# EAGLE design baby_board (EAGLE 7.1.0)
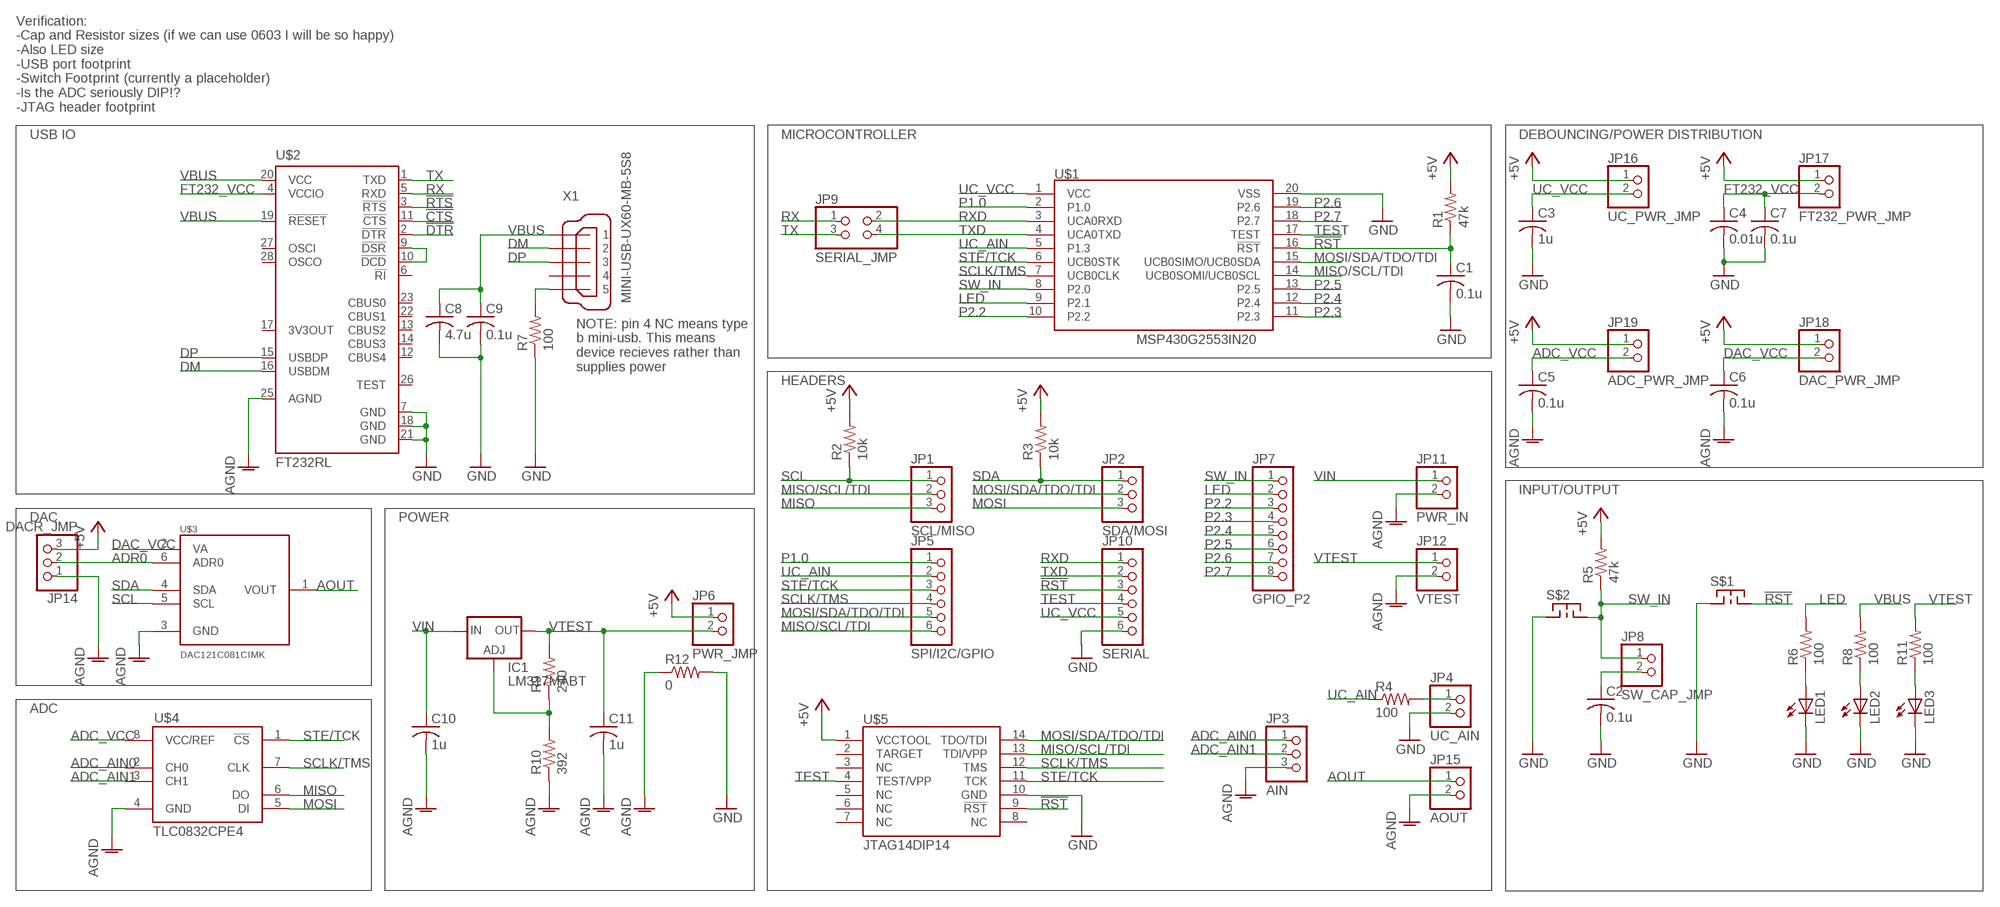
[diagram p0: schematic, sheet 1]

## Parts
C1  0.1u  C-USC0603  [C0603]
C2  0.1u  C-USC0603  [C0603]
C3  1u  C-USC0603  [C0603]
C4  0.01u  C-USC0603  [C0603]
C5  0.1u  C-USC0603  [C0603]
C6  0.1u  C-USC0603  [C0603]
C7  0.1u  C-USC0603  [C0603]
C8  4.7u  C-USC0603  [C0603]
C9  0.1u  C-USC0603  [C0603]
C10  1u  C-USC0603  [C0603]
C11  1u  C-USC0603  [C0603]
IC1  LM317MABT  [TO220L1]
JP1  SCL/MISO  PINHD-1X3  [1X03]
JP2  SDA/MOSI  PINHD-1X3  [1X03]
JP3  AIN  PINHD-1X3  [1X03]
JP4  UC_AIN  PINHD-1X2  [1X02]
JP5  SPI/I2C/GPIO  PINHD-1X6  [1X06]
JP6  PWR_JMP  PINHD-1X2  [1X02]
JP7  GPIO_P2  PINHD-1X8  [1X08]
JP8  SW_CAP_JMP  PINHD-1X2  [1X02]
JP9  SERIAL_JMP  PINHD-2X2  [2X02]
JP10  SERIAL  PINHD-1X6  [1X06]
JP11  PWR_IN  PINHD-1X2  [1X02]
JP12  VTEST  PINHD-1X2  [1X02]
JP14  DACR_JMP  PINHD-1X3  [1X03]
JP15  AOUT  PINHD-1X2  [1X02]
JP16  UC_PWR_JMP  PINHD-1X2  [1X02]
JP17  FT232_PWR_JMP  PINHD-1X2  [1X02]
JP18  DAC_PWR_JMP  PINHD-1X2  [1X02]
JP19  ADC_PWR_JMP  PINHD-1X2  [1X02]
LED1  LEDCHIP-LED0805  [CHIP-LED0805]
LED2  LEDCHIP-LED0805  [CHIP-LED0805]
LED3  LEDCHIP-LED0805  [CHIP-LED0805]
R1  47k  R-US_R0603  [R0603]
R2  10k  R-US_R0603  [R0603]
R3  10k  R-US_R0603  [R0603]
R4  100  R-US_R0603  [R0603]
R5  47k  R-US_R0603  [R0603]
R6  100  R-US_R0603  [R0603]
R7  100  R-US_R0603  [R0603]
R8  100  R-US_R0603  [R0603]
R9  240  R-US_R0603  [R0603]
R10  392  R-US_R0603  [R0603]
R11  100  R-US_R0603  [R0603]
R12  0  R-US_R0603  [R0603]
S$1  SWITCH_MOM_2_TEST  [TEST]
S$2  SWITCH_MOM_2_TEST  [TEST]
U$1  MSP430G2553IN20  [20-PDIP]
U$2  FT232RL  [SSOP28]
U$3  DAC121C081CIMK  [SOT-6]
U$4  TLC0832CPE4  [DIL08]
U$5  JTAG14DIP14  [DIL14]
X1  MINI-USB-UX60-MB-5S8  [UX60-MB-5S8]

## Nets
!CTS: U$2.11(!CTS)
!DTR: U$2.2(!DTR)
!RST: C1.1 JP10.3 R1.1 S$1.2 U$1.16(!RST) U$5.9(!RST)
!RTS: U$2.3(!RTS)
+5V: JP6.1 JP14.3 JP16.1 JP17.1 JP18.1 JP19.1 R1.2 R2.2 R3.2 R5.2 U$5.1(VCCTOOL)
ADC_AIN0: JP3.1 U$4.2(CH0)
ADC_AIN1: JP3.2 U$4.3(CH1)
ADC_VCC: C5.1 JP19.2 U$4.8(VCC/REF)
ADR0: JP14.2 U$3.6(ADR0)
AGND: C5.2 C6.2 C10.2 C11.2 JP3.3 JP11.2 JP12.2 JP14.1 JP15.2 R10.1 R12.1 U$2.25(AGND) U$3.3(GND) U$4.4(GND)
AOUT: JP15.1 U$3.1(VOUT)
DAC_VCC: C6.1 JP18.2 U$3.2(VA)
DM: U$2.16(USBDM) X1.2
DP: U$2.15(USBDP) X1.3
FT232_VCC: C4.1 C7.1 JP17.2 U$2.4(VCCIO)
GND: C1.2 C2.2 C3.2 C4.2 C7.2 C8.2 C9.2 JP4.2 JP10.6 LED1.C LED2.C LED3.C R7.1 R12.2 S$1.1 S$2.1 U$1.20(VSS) U$2.7(GND) U$2.18(GND) U$2.21(GND) U$5.10(GND)
LED: JP7.2 R6.2 U$1.9(P2.1)
MISO: JP1.3 U$4.6(DO)
MISO/SCL/TDI: JP1.2 JP5.6 U$1.14(UCB0SOMI/UCB0SCL) U$5.13(TDI/VPP)
MOSI: JP2.3 U$4.5(DI)
MOSI/SDA/TDO/TDI: JP2.2 JP5.5 U$1.15(UCB0SIMO/UCB0SDA) U$5.14(TDO/TDI)
N$1: JP4.1 R4.2
N$2: C2.1 JP8.2
N$3: LED1.A R6.1
N$4: U$2.9(!DSR) U$2.10(!DCD)
N$5: R7.2 X1.5
N$6: LED2.A R8.1
N$8: IC1.1(ADJ) R9.1 R10.2
N$9: LED3.A R11.1
P1.0: JP5.1 U$1.2(P1.0)
P2.2: JP7.3 U$1.10(P2.2)
P2.3: JP7.4 U$1.11(P2.3)
P2.4: JP7.5 U$1.12(P2.4)
P2.5: JP7.6 U$1.13(P2.5)
P2.6: JP7.7 U$1.19(P2.6)
P2.7: JP7.8 U$1.18(P2.7)
RX: JP9.1 U$2.5(RXD)
RXD: JP9.2 JP10.1 U$1.3(UCA0RXD)
SCL: JP1.1 R2.1 U$3.5(SCL)
SCLK/TMS: JP5.4 U$1.7(UCB0CLK) U$4.7(CLK) U$5.12(TMS)
SDA: JP2.1 R3.1 U$3.4(SDA)
STE/TCK: JP5.3 U$1.6(UCB0STK) U$4.1(!CS) U$5.11(TCK)
SW_IN: JP7.1 JP8.1 R5.1 S$2.2 U$1.8(P2.0)
TEST: JP10.4 U$1.17(TEST) U$5.4(TEST/VPP)
TX: JP9.3 U$2.1(TXD)
TXD: JP9.4 JP10.2 U$1.4(UCA0TXD)
UC_AIN: JP5.2 R4.1 U$1.5(P1.3)
UC_VCC: C3.1 JP10.5 JP16.2 U$1.1(VCC)
VBUS: C8.1 C9.1 R8.2 U$2.19(!RESET) U$2.20(VCC) X1.1
VIN: C10.1 IC1.3(IN) JP11.1
VTEST: C11.1 IC1.2(OUT) JP6.2 JP12.1 R9.2 R11.2
Unconnected: U$2.6(!RI) U$2.12(CBUS4) U$2.13(CBUS2) U$2.14(CBUS3) U$2.17(3V3OUT) U$2.22(CBUS1) U$2.23(CBUS0) U$2.26(TEST) U$2.27(OSCI) U$2.28(OSCO) U$5.2(TARGET) U$5.3(NC) U$5.5(NC) U$5.6(NC) U$5.7(NC) U$5.8(NC) X1.4

## Notes on the sheet
- Verification:
  -Cap and Resistor sizes (if we can use 0603 I will be so happy)
  -Also LED size
  -USB port footprint
  -Switch Footprint (currently a placeholder)
  -Is the ADC seriously DIP\!?
  -JTAG header footprint
- USB IO | MICROCONTROLLER | DEBOUNCING/POWER DISTRIBUTION
- NOTE: pin 4 NC means type
  b mini-usb. This means 
  device recieves rather than 
  supplies power
- HEADERS
- INPUT/OUTPUT
- DAC | POWER
- ADC

## Library data of the parts
C1-C11 = resistor:C-US: CAPACITOR, American symbol
IC1 = v-reg:LM317?*: 500 mA Adjustable Output Positive Voltage Regulator Source: http://www.onsemi.co.jp .. LM317M-D.PDF
JP1-JP3 JP14 = pinhead:PINHD-1X3: PIN HEADER
JP4 JP6 JP8 JP11 JP12 JP15-JP19 = pinhead:PINHD-1X2: PIN HEADER
JP5 JP10 = pinhead:PINHD-1X6: PIN HEADER
JP7 = pinhead:PINHD-1X8: PIN HEADER
JP9 = pinhead:PINHD-2X2: PIN HEADER
LED1-LED3 = led:LED: LED OSRAM: - CHIPLED LG R971, LG N971, LY N971, LG Q971, LY Q971, LO R971, LY R971 LH N974, LH R974 LS Q976, LO Q976, LY Q976 LO Q996 - Hyper CHIPLED LW Q18S LB Q993, LB Q99A, LB R99A - SideLED LS A670, LO A670, LY A670, LG A670, LP A670 LB A673, LV A673, LT A673, LW A673 LH A674 LY A675 LS A676, LA A676, LO A676, LY A676, LW A676 LS A679, LY A679, LG A679 - Hyper Micro SIDELED® LS Y876, LA Y876, LO Y876, LY Y876 LT Y87S - SmartLED LW L88C, LW L88S LB L89C, LB L89S, LG L890 LS L89K, LO L89K, LY L89K LS L896, LA L896, LO L896, LY L896 - TOPLED LS T670, LO T670, LY T670, LG T670, LP T670 LSG T670, LSP T670, LSY T670, LOP T670, LYG T670 LG T671, LOG T671, LSG T671 LB T673, LV T673, LT T673, LW T673 LH T674 LS T676, LA T676, LO T676, LY T676, LB T676, LH T676, LSB T676, LW T676 LB T67C, LV T67C, LT T67C, LS T67K, LO T67K, LY T67K, LW E67C LS E67B, LA E67B, LO E67B, LY E67B, LB E67C, LV E67C, LT E67C LW T67C LS T679, LY T679, LG T679 LS T770, LO T770, LY T770, LG T770, LP T770 LB T773, LV T773, LT T773, LW T773 LH T774 LS E675, LA E675, LY E675, LS T675 LS T776, LA T776, LO T776, LY T776, LB T776 LHGB T686 LT T68C, LB T68C - Hyper Mini TOPLED® LB M676 - Mini TOPLED Santana® LG M470 LS M47K, LO M47K, LY M47K Source: http://www.osram.convergy.de LUXEON: - LUMILED® LXK2-PW12-R00, LXK2-PW12-S00, LXK2-PW14-U00, LXK2-PW14-V00 LXK2-PM12-R00, LXK2-PM12-S00, LXK2-PM14-U00 LXK2-PE12-Q00, LXK2-PE12-R00, LXK2-PE12-S00, LXK2-PE14-T00, LXK2-PE14-U00 LXK2-PB12-K00, LXK2-PB12-L00, LXK2-PB12-M00, LXK2-PB14-N00, LXK2-PB14-P00, LXK2-PB14-Q00 LXK2-PR12-L00, LXK2-PR12-M00, LXK2-PR14-Q00, LXK2-PR14-R00 LXK2-PD12-Q00, LXK2-PD12-R00, LXK2-PD12-S00 LXK2-PH12-R00, LXK2-PH12-S00 LXK2-PL12-P00, LXK2-PL12-Q00, LXK2-PL12-R00 Source: www.luxeon.com KINGBRIGHT: KA-3528ASYC Source: www.kingbright.com
R1-R12 = resistor:R-US_: RESISTOR, American symbol
S$1 S$2 = switch_glaser:SWITCH_MOM_2_
U$1 = msp430:MSP430: 16-bit microcontroller, 20 pin variant
U$2 = ftdichip:FT232R: Source: http://www.ftdichip.com/Documents/DataSheets/DS_FT232R_v104.pdf; MPN: FT232RL; OC_FARNELL: 1146032; OC_NEWARK: 91K9918
U$3 = dac_glaser:DAC121C081
U$4 = adc_glaser:TLC0832C
U$5 = jtag_glaser:JTAG14
X1 = con-hirose:MINI-USB-: MINI USB Connector Source: http://www.hirose.co.jp/cataloge_hp/e24000019.pdf; OC_FARNELL: unknown; OC_NEWARK: unknown

## Board
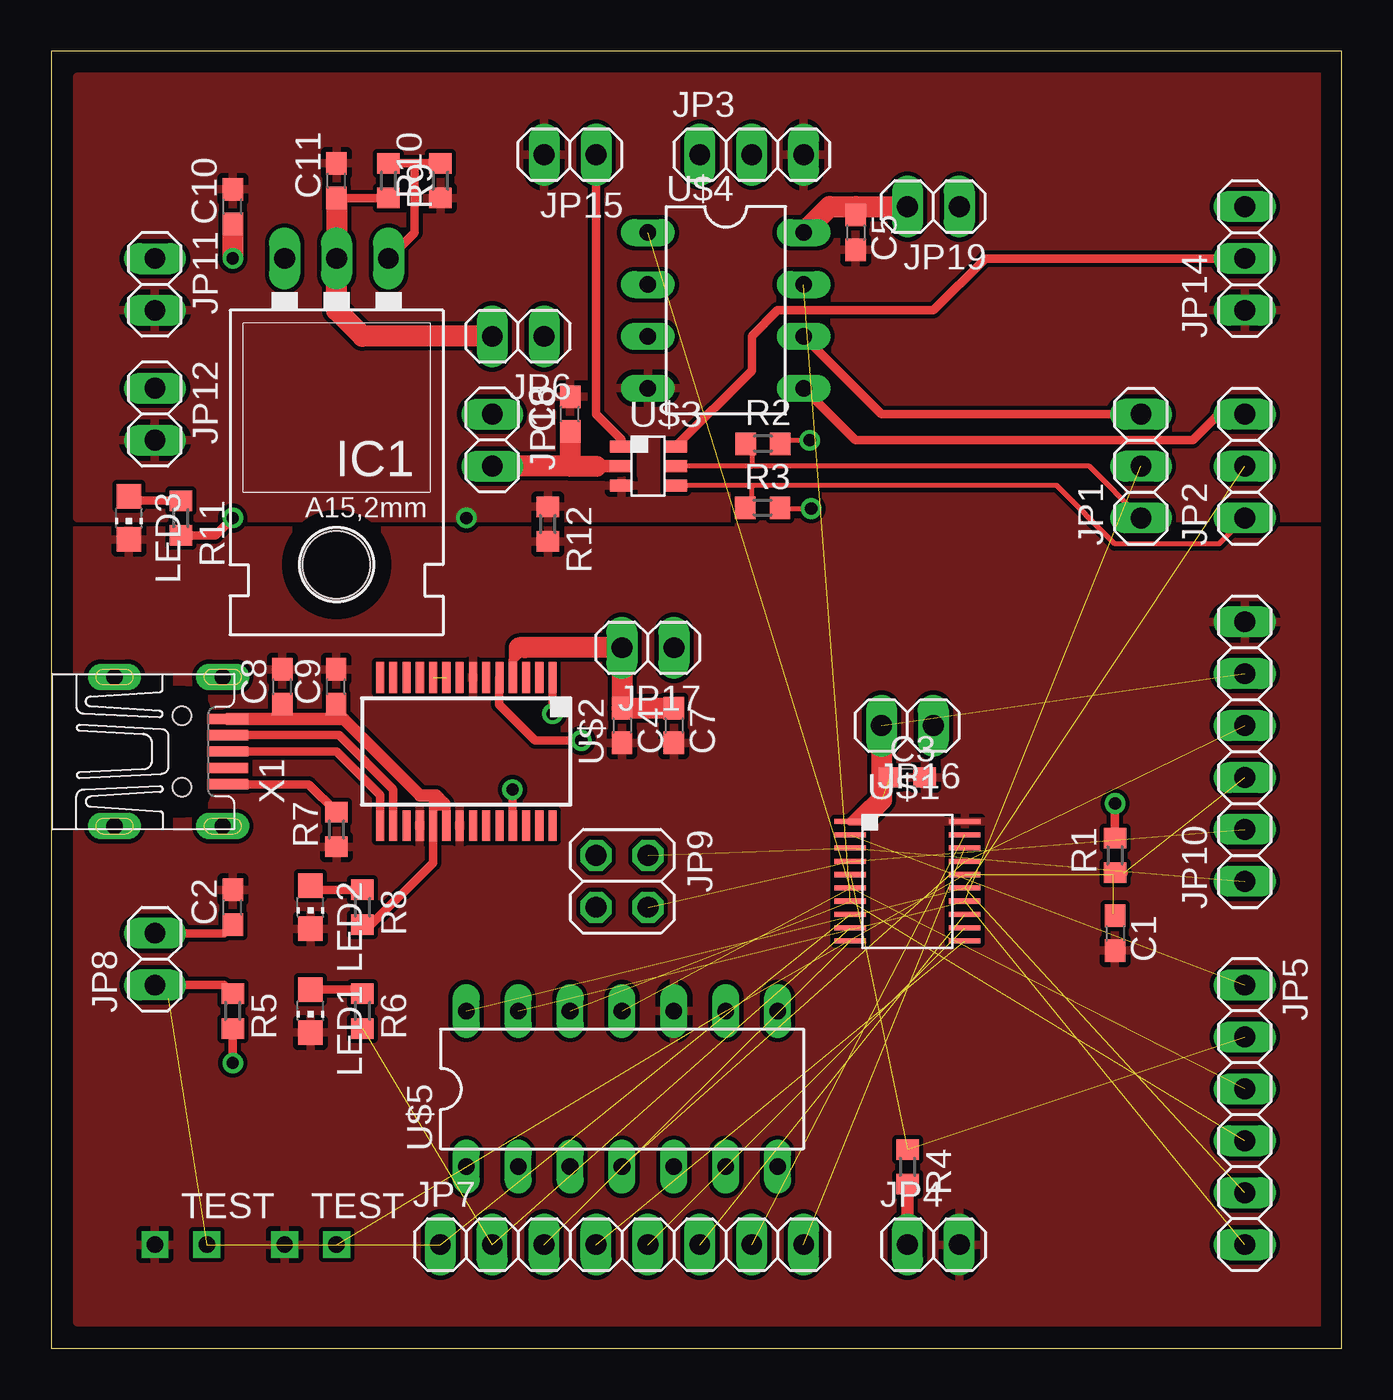
[diagram p1: board, top side]
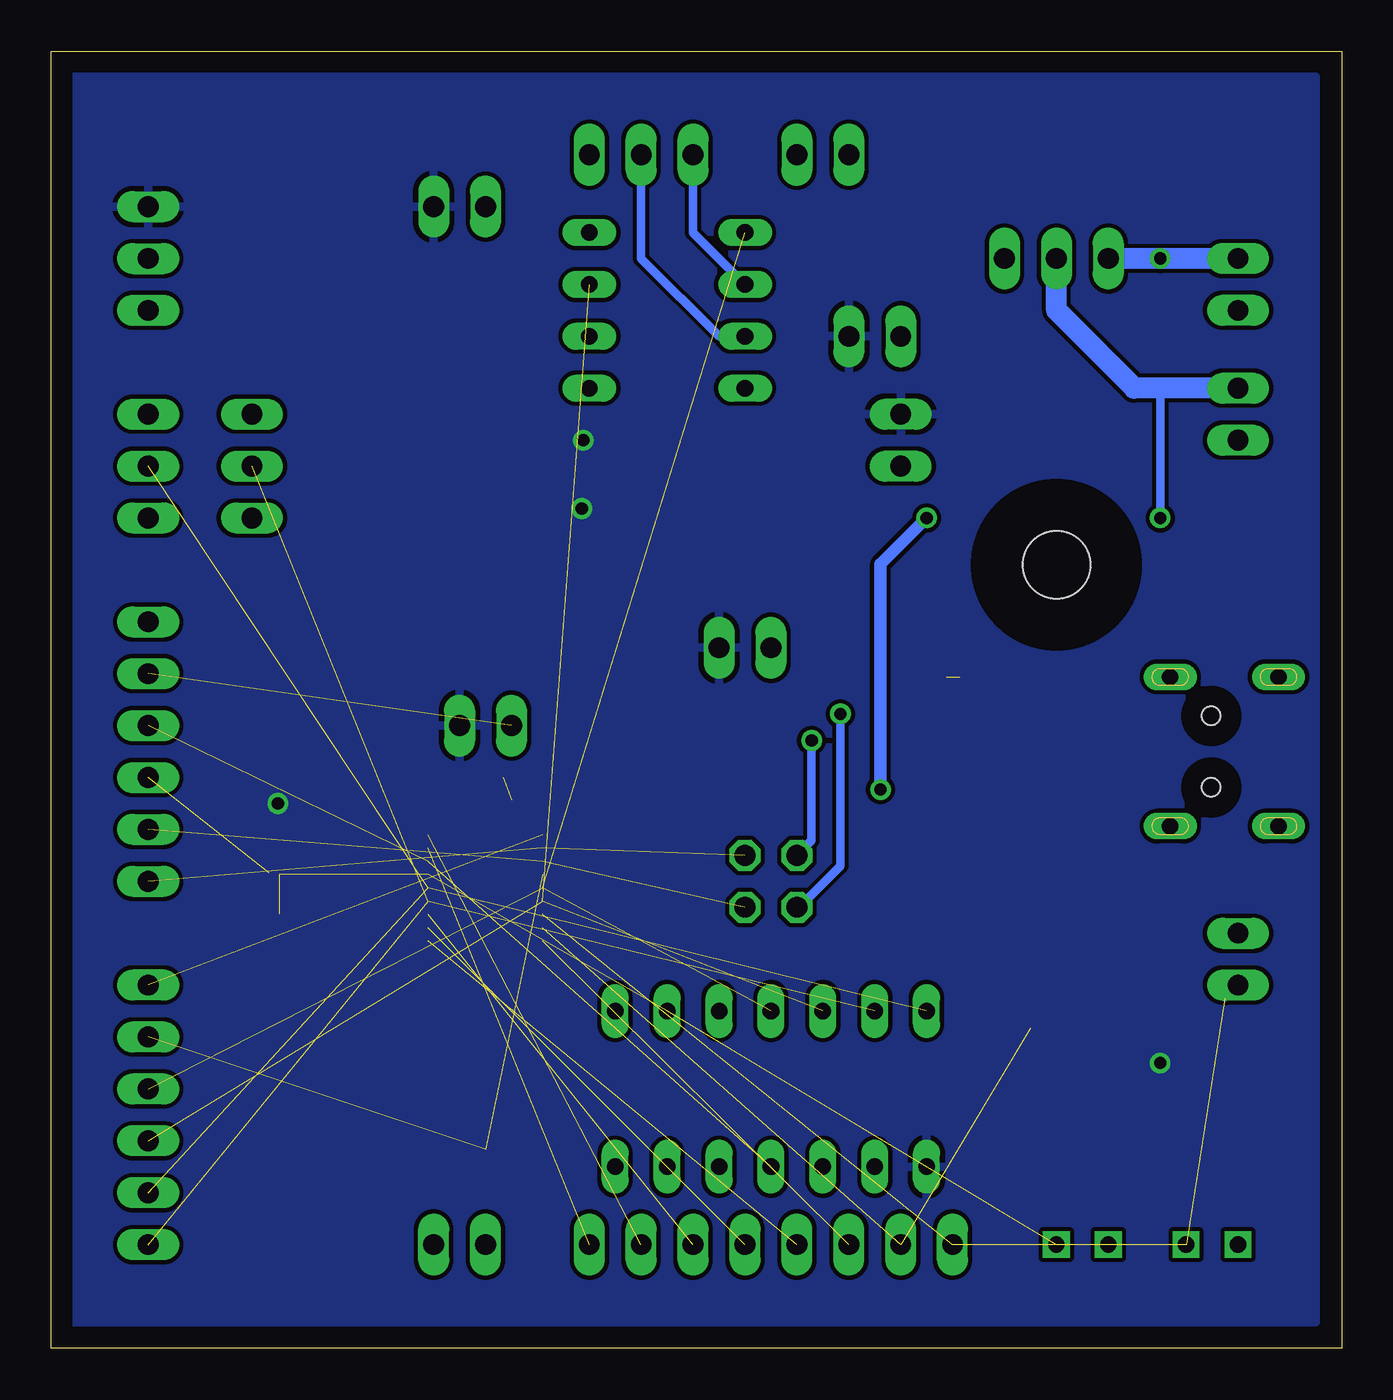
[diagram p2: board, bottom side, seen from below]

Size 63.17 x 63.49 mm. Coordinates in mm from the lower left corner, seen from the top.
Outline: 0,0 63.17,0 63.17,63.49 0,63.49 0,0
Copper layers (1*16): Top 0.035mm / dielectric 1.5mm / Bottom 0.035mm
Design rules "default": minimum track width 10mil, minimum drill 24mil, track to track 8mil, track to pad 8mil, pad to pad 8mil, via to via 8mil, smd to smd 8mil, copper to edge 40mil, drill to drill 8mil, minimum pad ring 10mil, minimum via ring 8mil, stop-mask expansion 4mil, vias tented up to drill 0mil, thermal gap 10mil

### Footprints (pad centres in the part's own frame; a part is rotated, then mirrored left to right if it is on the bottom)
C0603 = smd 1.1 x 1: 1 -0.85,0; 2 0.85,0
TO220L1 = drill 1.016 long: 1 -2.54,-3.81; 2 0,-3.81; 3 2.54,-3.81 | hole 3.302: 0,11.176
1X03 = drill 1.016 long: 1 -2.54,0; 2 0,0; 3 2.54,0
1X02 = drill 1.016 long: 1 -1.27,0; 2 1.27,0
1X06 = drill 1.016 long: 1 -6.35,0; 2 -3.81,0; 3 -1.27,0; 4 1.27,0; 5 3.81,0; 6 6.35,0
1X08 = drill 1.016 long: 1 -8.89,0; 2 -6.35,0; 3 -3.81,0; 4 -1.27,0; 5 1.27,0; 6 3.81,0; 7 6.35,0; 8 8.89,0
2X02 = drill 1.016 octagon: 1 -1.27,-1.27; 2 -1.27,1.27; 3 1.27,-1.27; 4 1.27,1.27
CHIP-LED0805 = smd 1.2 x 1.2: A 0,-1.05; C 0,1.05
R0603 = smd 1 x 1.1: 1 -0.85,0; 2 0.85,0
TEST = drill 0.8 square: 1 -1.27,-1.27; 2 1.27,-1.27
20-PDIP = smd 0.25 x 1.55: 1 -2.925,-2.8; 2 -2.275,-2.8; 3 -1.625,-2.8; 4 -0.975,-2.8; 5 -0.325,-2.8; 6 0.325,-2.8; 7 0.975,-2.8; 8 1.625,-2.8; 9 2.275,-2.8; 10 2.925,-2.8; 11 2.925,2.8; 12 2.275,2.8; 13 1.625,2.8; 14 0.975,2.8; 15 0.325,2.8; 16 -0.325,2.8; 17 -0.975,2.8; 18 -1.625,2.8; 19 -2.275,2.8; 20 -2.925,2.8
SSOP28 = smd 0.4 x 1.5: 1 -4.225,-3.625; 2 -3.575,-3.625; 3 -2.925,-3.625; 4 -2.275,-3.625; 5 -1.625,-3.625; 6 -0.975,-3.625; 7 -0.325,-3.625; 8 0.325,-3.625; 9 0.975,-3.625; 10 1.625,-3.625; 11 2.275,-3.625; 12 2.925,-3.625; 13 3.575,-3.625; 14 4.225,-3.625; 15 4.225,3.625; 16 3.575,3.625; 17 2.925,3.625; 18 2.275,3.625; 19 1.625,3.625; 20 0.975,3.625; 21 0.325,3.625; 22 -0.325,3.625; 23 -0.975,3.625; 24 -1.625,3.625; 25 -2.275,3.625; 26 -2.925,3.625; 27 -3.575,3.625; 28 -4.225,3.625
SOT-6 = smd 0.6 x 1.1: 1 -0.95,-1.3; 2 0,-1.3; 3 0.95,-1.3; 4 0.95,1.35; 5 0,1.35; 6 -0.95,1.35
DIL08 = drill 0.813 long: 1 -3.81,-3.81; 2 -1.27,-3.81; 3 1.27,-3.81; 4 3.81,-3.81; 5 3.81,3.81; 6 1.27,3.81; 7 -1.27,3.81; 8 -3.81,3.81
DIL14 = drill 0.813 long: 1 -7.62,-3.81; 2 -5.08,-3.81; 3 -2.54,-3.81; 4 0,-3.81; 5 2.54,-3.81; 6 5.08,-3.81; 7 7.62,-3.81; 8 7.62,3.81; 9 5.08,3.81; 10 2.54,3.81; 11 0,3.81; 12 -2.54,3.81; 13 -5.08,3.81; 14 -7.62,3.81
UX60-MB-5S8 = smd 2 x 0.5: 1 8.65,1.6; 2 8.65,0.8; 3 8.65,0; 4 8.65,-0.8; 5 8.65,-1.6 | drill 0.8 long: M1 3.1,-3.65; M2 3.1,3.65; M3 8.4,3.65; M4 8.4,-3.65 | hole 0.9: 6.4,-1.75; 6.4,1.75

### Placement (x,y rotation side)
C1  52.07,20.32 270 top
C2  8.89,21.59 90 top
C3  41.91,27.94 0 top
C4  27.94,30.48 270 top
C5  39.37,54.61 270 top
C6  25.4,45.72 90 top
C7  30.48,30.48 270 top
C8  11.32,32.38 90 top
C9  13.95,32.38 90 top
C10  8.89,55.88 90 top
C11  13.97,57.15 90 top
IC1  13.97,49.53 180 top
JP1  53.34,43.18 90 top
JP2  58.42,43.18 90 top
JP3  34.29,58.42 0 top
JP4  43.18,5.08 0 top
JP5  58.42,11.43 270 top
JP6  22.86,49.53 180 top
JP7  27.94,5.08 0 top
JP8  5.08,19.05 90 top
JP9  27.94,22.86 270 top
JP10  58.42,29.21 90 top
JP11  5.08,52.07 270 top
JP12  5.08,45.72 270 top
JP14  58.42,53.34 90 top
JP15  25.4,58.42 180 top
JP16  41.91,30.48 180 top
JP17  29.21,34.29 180 top
JP18  21.59,44.45 270 top
JP19  43.18,55.88 180 top
LED1  12.7,16.51 180 top
LED2  12.7,21.59 180 top
LED3  3.81,40.64 180 top
R1  52.07,24.13 90 top
R2  34.84,44.28 0 top
R3  34.82,41.14 0 top
R4  41.91,8.89 270 top
R5  8.89,16.51 270 top
R6  15.24,16.51 270 top
R7  13.97,25.4 90 top
R8  15.24,21.59 270 top
R9  16.51,57.15 270 top
R10  19.05,57.15 90 top
R11  6.35,40.64 270 top
R12  24.31,40.34 270 top
S$1  12.7,6.35 0 top
S$2  6.35,6.35 0 top
U$1  41.91,22.86 270 top
U$2  20.32,29.21 180 top
U$3  29.21,43.18 270 top
U$4  33.02,50.8 270 top
U$5  27.94,12.7 0 top
X1  0,29.21 0 top

### Tracks (layer width: path | path; a pad name or v marks a point on that pad's centre or on a via)
!RST  (5 unrouted)
  Top 0.406: 51.98,23.18 R1.1 52.49,23.28 | 51.98,21.27 C1.1
+5V  (via drill 0.6)
  Top 0.254: R2.2 35.86,44.45 v37.13,44.45 | R3.2 35.71,41.1 v37.2,41.1
  Top 0.406: R5.2 v8.89,13.97 | R1.2 v52.07,26.67
  pour Bottom: 1.27,62.23 62.23,62.23 62.23,1.27 1.27,1.27
ADC_AIN0
  Bottom 0.406: JP3.1 31.75,54.61 U$4.2
ADC_AIN1
  Bottom 0.406: U$4.3 30.48,49.53 34.29,53.34 JP3.2
ADC_VCC
  Top 1.016: 39.37,55.88 38.1,55.88 U$4.8 | 39.37,55.88 JP19.2 | 39.37,55.88 C5.1
ADR0
  Top 0.406: JP14.2 45.72,53.34 43.18,50.8 35.56,50.8 34.29,49.53 34.29,47.86 U$3.6
AGND  (via drill 0.6)
  Top 0.406: U$2.25 22.59,27.34 v22.58,27.35
  Bottom 0.61: v22.58,27.35 22.58,38.38 v20.32,40.64
  pour Top: 1.27,62.23 1.27,40.64 62.23,40.64 62.23,62.23
AOUT
  Top 0.406: U$3.1 27.91,44.48 26.67,45.72 JP15.1
DAC_VCC
  Top 0.61: 26.67,43.18 U$3.2
  Top 1.016: 25.4,43.18 JP18.2 | C6.1 25.4,43.18 | 25.4,43.18 26.67,43.18
DM
  Top 0.406: U$2.16 16.75,27.36 14.1,30.01 X1.2
DP
  Top 0.406: U$2.15 16.09,27.09 13.97,29.21 X1.3
FT232_VCC
  Top 0.406: C4.1 | U$2.4 22.59,33.7 23.19,34.29
  Top 1.016: C7.1 C4.1 JP17.2 23.19,34.29 22.92,34.29 22.91,34.3
GND
  pour Top (rank 6): 1.27,1.27 1.27,62.23 62.23,62.23 62.23,1.27
LED  (2 unrouted)
MISO
  Top 0.406: JP1.3 40.64,45.72 U$4.6
MISO/SCL/TDI  (3 unrouted)
MOSI
  Top 0.406: JP2.3 57.15,45.72 55.88,44.45 39.37,44.45 U$4.5
MOSI/SDA/TDO/TDI  (3 unrouted)
N$1
  Top 0.61: JP4.1 R4.2
N$2
  Top 0.406: C2.1 8.47,20.32 JP8.2
N$3
  Top 0.406: R6.1 15.04,17.56 LED1.A
N$4  (1 unrouted)
N$5
  Top 0.406: X1.5 12.61,27.61 R7.2
N$6
  Top 0.406: LED2.A 12.9,22.44 R8.1
N$7
  Top 0.406: 39.1,25.79 39.15,25.79 39.98,26.62
N$8
  Top 0.406: R9.1 17.78,58 | 17.78,58 R10.2 | IC1.1 17.78,54.61 17.78,58
N$9
  Top 0.406: R11.1 4.01,41.49 LED3.A
N$10
  Top 0.406: 39.12,25.78 40,25.78 40.31,26.09
N$11
  Top 0.406: 22.6,33.39 22.6,34.33 22.61,34.34
N$13
  Top 0.406: 19.32,26.53 18.82,26.53
P1.0  (1 unrouted)
P2.2  (1 unrouted)
P2.3  (1 unrouted)
P2.4  (1 unrouted)
P2.5  (1 unrouted)
P2.6  (1 unrouted)
P2.7  (1 unrouted)
RX  (via drill 0.6)
  Top 0.406: v25.95,29.75 23.69,29.75 21.93,31.51 21.93,32.82 U$2.5
  Bottom 0.406: JP9.1 25.95,24.85 v25.95,29.75
RXD  (2 unrouted)
SCL
  Top 0.254: JP1.1 50.8,43.18 34.29,43.18 | 34.29,43.18 U$3.5 | R2.1 34.29,43.98 34.29,43.18
SCLK/TMS  (3 unrouted)
SDA
  Top 0.254: JP2.1 57.15,39.37 52.07,39.37 49.21,42.23 34.29,42.23 | 34.29,42.23 U$3.4 | R3.1 34.29,41.46 34.29,42.23
STE/TCK  (3 unrouted)
SW_IN  (3 unrouted)
  Top 0.406: R5.1 8.47,17.78 JP8.1
  Bottom 0.305: 5.74,17.12 JP8.1
TEST  (2 unrouted)
TX  (via drill 0.6)
  Top 0.406: v24.54,31.05 U$2.1
  Bottom 0.406: v24.54,31.05 24.54,23.61 26.56,21.59 JP9.3
TXD  (2 unrouted)
UC_AIN  (2 unrouted)
UC_VCC  (2 unrouted)
  Top 0.406: 39.95,26.16 39.58,25.79 U$1.1
  Top 1.016: JP16.2 40.64,26.85 39.95,26.16
VBUS
  Top 0.406: R8.2 15.67,20.74 18.69,23.76 U$2.19 18.7,26.98 18.61,27.06 | U$2.20 19.34,26.55 19.14,26.75 | C8.1 11.32,30.92 11.43,30.81 | C9.1 13.95,30.83 13.97,30.81
  Top 0.61: X1.1 11.43,30.81 13.97,30.81 14.31,30.81 18.06,27.06 18.61,27.06 18.83,27.06 19.14,26.75 19.23,26.66
VIN  (via drill 0.6)
  Top 1.016: C10.1 v8.89,53.34
  Bottom 1.016: JP11.1 v8.89,53.34 IC1.3
VTEST  (via drill 0.6)
  Top 0.406: C11.1 R9.2 | R11.2 8.04,39.79 v8.89,40.64
  Top 1.016: C11.1 IC1.2 13.97,50.8 15.24,49.53 JP6.2
  Bottom 0.406: v8.89,40.64 8.89,46.99
  Bottom 1.016: JP12.1 8.89,46.99 10.16,46.99 13.97,50.8 IC1.2